# EAGLE design HAB_APRS_V1.0 (EAGLE 9.5.1)
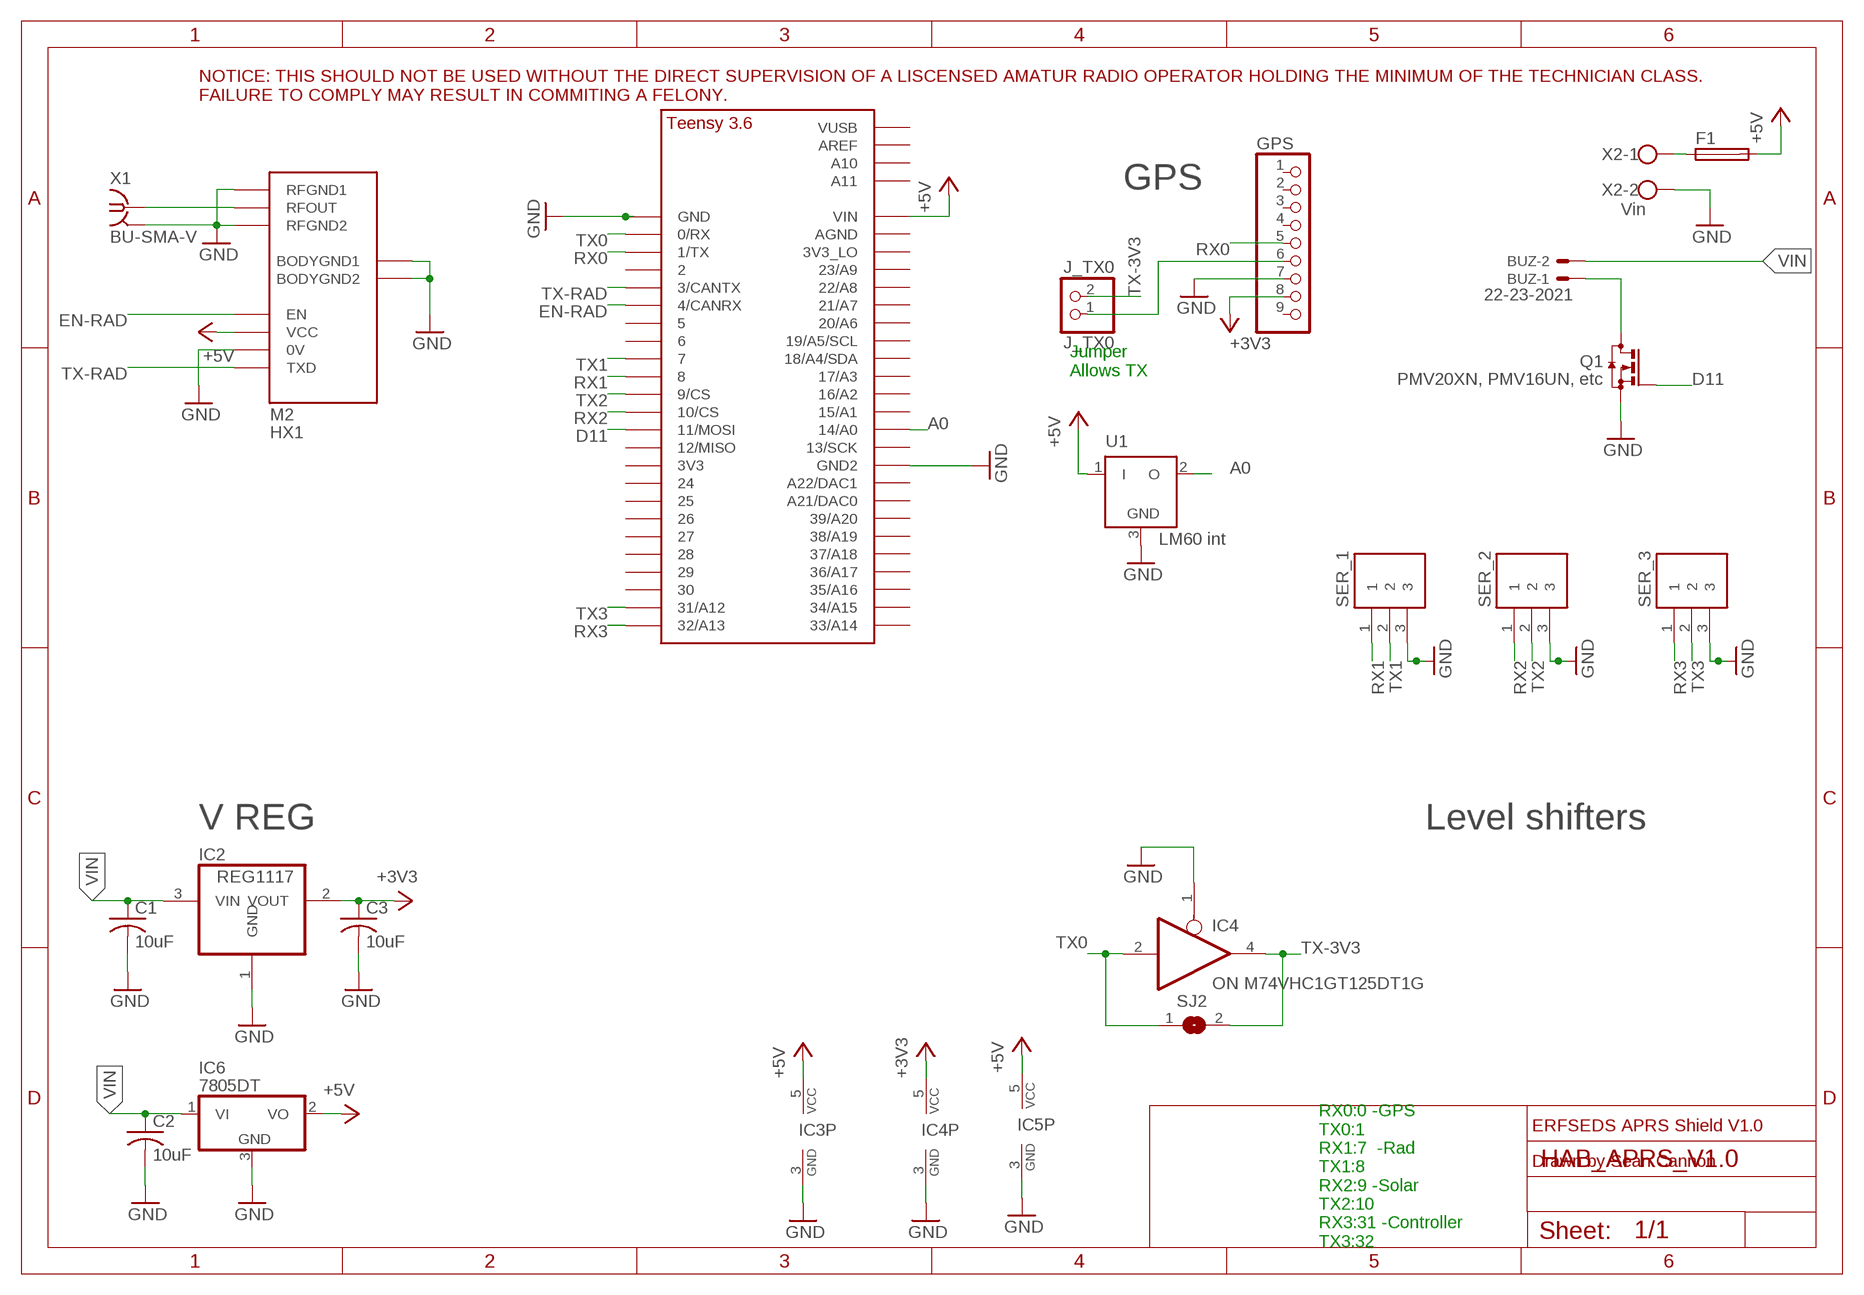
[diagram p0: schematic, sheet 1]

## Parts
BUZ  22-23-2021  [22-23-2021]
C1  10uF  C-USC0805  [C0805]
C2  10uF  C-USC0805  [C0805]
C3  10uF  C-USC0805  [C0805]
F1  FUSE_CHIP(6126-METRIC)  [FUSC6126X294N]
GPS  PINHD-1X9  [1X09-BIG]
IC2  REG1117  [SOT223]
IC3  ON M74VHC1GT125DT1G  74AHC1G125DBV  [SOT23-5]
IC4  ON M74VHC1GT125DT1G  74AHC1G125DBV  [SOT23-5]
IC5  ON M74VHC1GT125DT1G  74AHC1G125DBV  [SOT23-5]
IC6  7805DT  [TO252]
J_TX0  J_TX0  PINHD-1X2  [1X02]
M2  HX1  [HX1]
Q1  PMV20XN, PMV16UN, etc  BSS123  [SOT23]
SER_1  MOLEX_SL_03-70551  [SL_70551_3]
SER_2  MOLEX_SL_03-70551  [SL_70551_3]
SER_3  MOLEX_SL_03-70551  [SL_70551_3]
SJ2  SJ  [SJ]
U1  LM60 int  LM60  [TO92]
U$1  TEENSY_3.5/3.6_BASIC  [TEENSY_3.5/3.6_BASIC]
X1  BU-SMA-V  [BU-SMA-V]
X2  Vin  W237-102  [W237-102]

## Nets
+3V3 [20]: C3.1 GPS.8 IC2.2(VOUT) IC4.5(VCC)
+5V [20]: F1.2 IC3.5(VCC) IC5.5(VCC) IC6.2(VO) M2.VCC U1.1(I) U$1.VIN
A0: U1.2(O) U$1.14/A0
D11: Q1.1(G) U$1.11/MOSI
EN-RAD: M2.EN U$1.4/CANRX
GND: C1.2 C2.2 C3.2 GPS.7 IC2.1(GND) IC3.3(GND) IC4.1(OE) IC4.3(GND) IC5.3(GND) IC6.3(GND) M2.0V M2.BODYGND1 M2.BODYGND2 M2.RFGND1 M2.RFGND2 Q1.2(S) SER_1.3 SER_2.3 SER_3.3 U1.3(GND) U$1.GND U$1.GND2 X1.2(GND) X2.2
N$1: BUZ.1 Q1.3(D)
N$2: GPS.6 J_TX0.1
N$8: F1.1 X2.1
RFOUT [20]: M2.RFOUT X1.1
RX0: GPS.5 U$1.1/TX
RX1: SER_1.1 U$1.8
RX2: SER_2.1 U$1.10/CS
RX3: SER_3.1 U$1.32/A13
TX0: IC4.2(I) SJ2.1 U$1.0/RX
TX1: SER_1.2 U$1.7
TX2: SER_2.2 U$1.9/CS
TX3: SER_3.2 U$1.31/A12
TX-3V3: IC4.4(O) J_TX0.2 SJ2.2
TX-RAD: M2.TXD U$1.3/CANTX
VIN [30]: BUZ.2 C1.1 C2.1 IC2.3(VIN) IC6.1(VI)
Unconnected: GPS.1 GPS.2 GPS.3 GPS.4 GPS.9 IC3.1(OE) IC3.2(I) IC3.4(O) IC5.1(OE) IC5.2(I) IC5.4(O) U$1.2 U$1.3V3 U$1.3V3_LO U$1.5 U$1.6 U$1.12/MISO U$1.13/SCK U$1.15/A1 U$1.16/A2 U$1.17/A3 U$1.18/A4/SDA U$1.19/A5/SCL U$1.20/A6 U$1.21/A7 U$1.21/DAC0(A21/DAC0) U$1.22/A8 U$1.23/A9 U$1.24 U$1.25 U$1.26 U$1.27 U$1.28 U$1.29 U$1.30 U$1.33/A14 U$1.34/A15 U$1.35/A16 U$1.36/A17 U$1.37/A18 U$1.38/A19 U$1.39/A20 U$1.A10 U$1.A11 U$1.A22/DAC1 U$1.AGND U$1.AREF U$1.VUSB

## Notes on the sheet
- NOTICE: THIS SHOULD NOT BE USED WITHOUT THE DIRECT SUPERVISION OF A LISCENSED AMATUR RADIO OPERATOR HOLDING THE MINIMUM OF THE TECHNICIAN CLASS. 
  FAILURE TO COMPLY MAY RESULT IN COMMITING A FELONY.
- GPS
- Jumper
  Allows TX
- V REG | Level shifters
- ERFSEDS APRS Shield V1.0
- Drawn by Sean Cannon
- RX0:0 -GPS
  TX0:1
  RX1:7  -Rad
  TX1:8
  RX2:9 -Solar
  TX2:10
  RX3:31 -Controller
  TX3:32

## Power pins joined to a net without a drawn wire
GND: X1.3(GND) X1.4(GND) X1.5(GND)

## Library data of the parts
BUZ = con-molex:22-23-2021: .100" (2.54mm) Center Header - 2 Pin; MF: MOLEX; MPN: 22-23-2021; OC_FARNELL: 1462926; OC_NEWARK: 25C3832
C1-C3 = rcl:C-US: CAPACITOR, American symbol; SPICEPREFIX: C
F1 = Circuit-Protection:FUSE: Fuse - Generic; CATEGORY: Circuit-Protection; SUB-CATEGORY: Fuse
GPS = adafruit:PINHD-1X9: Pin header 1x10 0.1" spacing With round pins
IC2 = burr-brown:REG1117: 800mA and 1A Low Dropout (LDO) Positive Regulator 1.8V, 2.5V, 2.85V, 3.3V, 5V, and Adj; MPN: REG1117; OC_FARNELL: 1097566; OC_NEWARK: 14P6981
IC3-IC5 = 74xx-little-us:74*1G125: Single Bus Buffer Gate with 3-State Output
IC6 = adafruit:78*: Positive VOLTAGE REGULATOR Added bigger pads to the TO-92 package
J_TX0 = pinhead:PINHD-1X2: PIN HEADER
M2 = trackuino:HX1
Q1 = transistor-small-signal:BSS123: N-CHANNEL MOS FET
SER_1-SER_3 = molex-sl-connectors_jw:MOLEX_SL_03: Molex SL-Series PCB Header, 3-Pos, 0.1" (2.54mm) Centers
SJ2 = jumper:SJ: SMD solder JUMPER
U1 = trackuino:LM60
U$1 = Teensy356:TEENSY_3.5/3.6_BASIC
X1 = con-coax:BU-SMA-V: FEMALE SMA CONNECTOR Radiall distributor RS 112-3794; OC_FARNELL: unknown; OC_NEWARK: unknown
X2 = con-wago-500:W237-102: WAGO SCREW CLAMP; MPN: 237-102; OC_FARNELL: unknown; OC_NEWARK: 70K9898

## Net classes
2 20: width 0.508 mm
3 30: width 0.762 mm

## Board
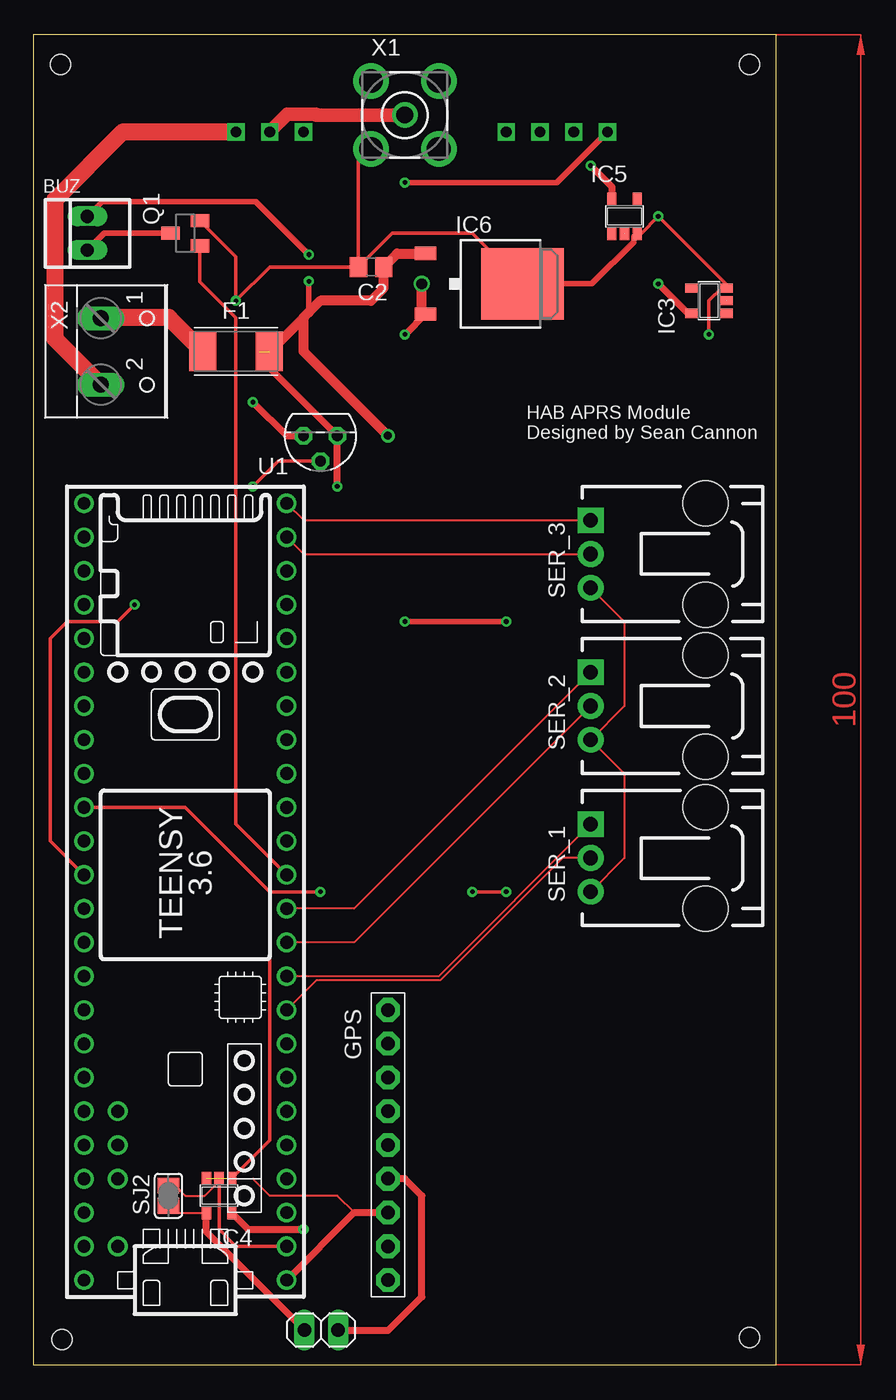
[diagram p1: board, top side]
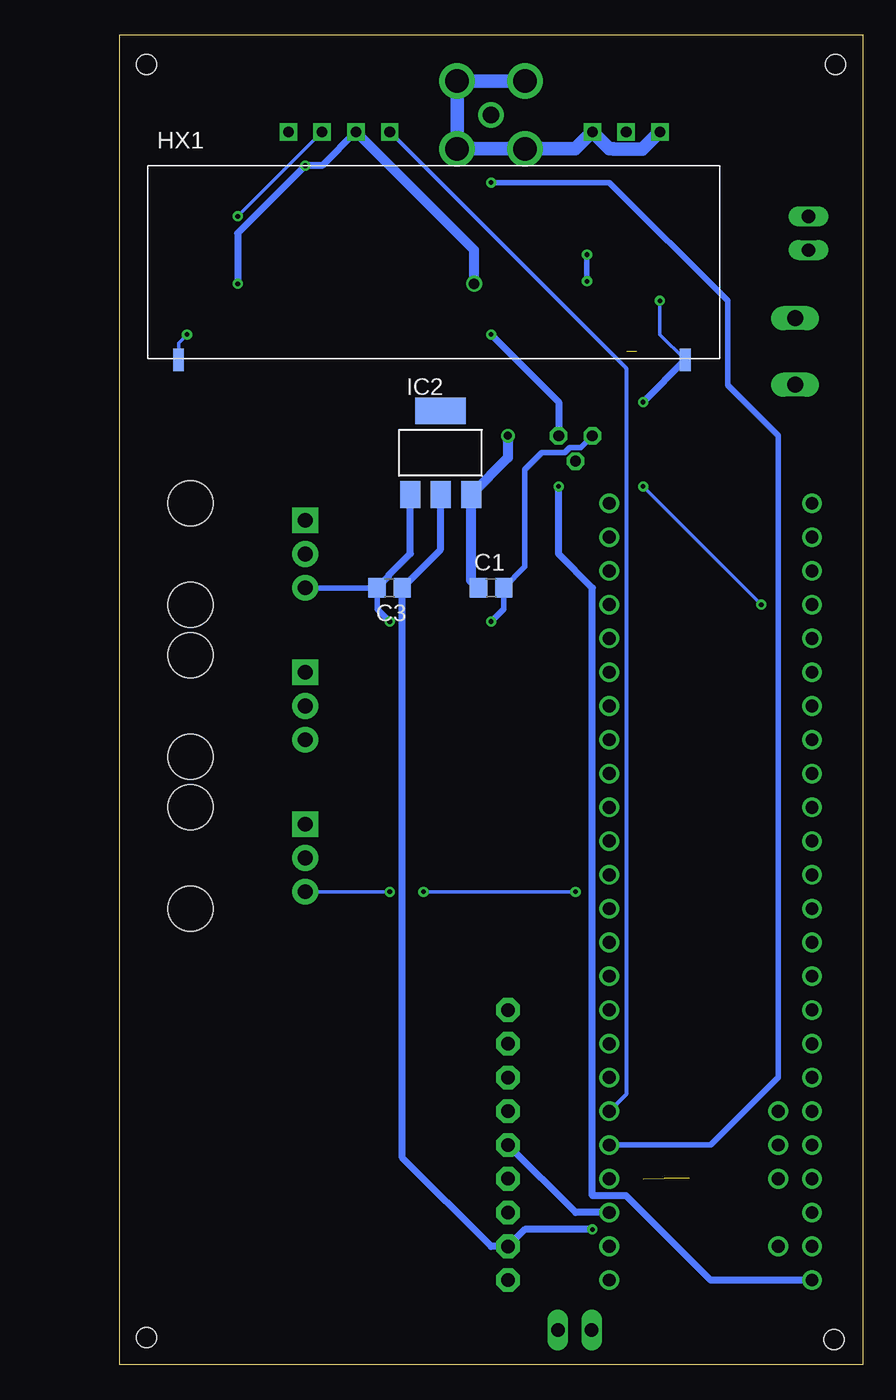
[diagram p2: board, bottom side, seen from below]

Size 55.86 x 100 mm. Coordinates in mm from the lower left corner, seen from the top.
Outline: 0,0 55.86,0 55.86,100 0,100 0,0
Copper layers (1*16): Top 0.035mm / dielectric 1.5mm / Bottom 0.035mm
Design rules "default": minimum track width 6mil, minimum drill 0.35mm, track to track 6mil, track to pad 6mil, pad to pad 6mil, via to via 6mil, smd to smd 6mil, copper to edge 40mil, drill to drill 6mil, minimum pad ring 10mil, minimum via ring 8mil, stop-mask expansion 4mil, vias tented up to drill 0mil, thermal gap 10mil
Holes 1.52 mm at 2.04,97.79 53.84,97.79 53.84,2.04 2.16,1.89

### Footprints (pad centres in the part's own frame; a part is rotated, then mirrored left to right if it is on the bottom)
22-23-2021 = drill 1 long: 1 -1.27,0; 2 1.27,0
C0805 = smd 1.3 x 1.5: 1 -0.95,0; 2 0.95,0
FUSC6126X294N = smd 2.015 x 2.952: 1 -2.5,0; 2 2.5,0
1X09-BIG = drill 1.016 pad 1.778 octagon: 1 -10.16,0; 2 -7.62,0; 3 -5.08,0; 4 -2.54,0; 5 0,0; 6 2.54,0; 7 5.08,0; 8 7.62,0; 9 10.16,0
SOT223 = smd 1.499 x 2.007: 1 -2.261,-3.15; 2 0.025,-3.15; 3 2.311,-3.15 | smd 3.81 x 2.007: 4 0,3.15
SOT23-5 = smd 0.69 x 0.99: 1 -0.95,-1.29; 2 0,-1.29; 3 0.95,-1.29; 4 0.95,1.3; 5 -0.95,1.3
TO252 = smd 1 x 1.6: 1 -2.28,-4.8; 2 2.28,-4.8 | smd 5.4 x 6.2: 3 0,2.5
1X02 = drill 1.016 long: 1 -1.27,0; 2 1.27,0
HX1 = drill 0.8 square: 0V 25.4,-8.89; EN 20.32,-8.89; RFGND1 0,-8.89; RFGND2 5.08,-8.89; RFOUT 2.54,-8.89; TXD 27.94,-8.89; VCC 22.86,-8.89 | smd 0.813 x 1.676: BODYGND1 -1.905,8.255; BODYGND2 36.195,8.255
SOT23 = smd 1 x 1.4: 1 -0.95,-1.1; 2 0.95,-1.1; 3 0,1.1
SL_70551_3 = drill 1.1 pad 1.93 square: 1 -2.54,-5.08 | drill 1.1 pad 1.93: 2 0,-5.08; 3 2.54,-5.08 | hole 3.404: -3.81,3.556; 3.81,3.556
SJ = smd 1.168 x 1.6: 1 -0.762,0; 2 0.762,0
TO92 = drill 0.813 octagon: 1 -1.27,0; 2 0,1.905; 3 1.27,0
TEENSY_3.5/3.6_BASIC = drill 0.965: 0/RX -25.4,-7.62; 1/TX -22.86,-7.62; 2 -20.32,-7.62; 3/CANTX -17.78,-7.62; 3V3 7.62,-7.62; 3V3_LO -22.86,7.62; 4/CANRX -15.24,-7.62; 5 -12.7,-7.62; 6 -10.16,-7.62; 7 -7.62,-7.62; 8 -5.08,-7.62; 9/CS -2.54,-7.62; 10/CS 0,-7.62; 11/MOSI 2.54,-7.62; 12/MISO 5.08,-7.62; 13/SCK 5.08,7.62; 14/A0 2.54,7.62; 15/A1 0,7.62; 16/A2 -2.54,7.62; 17/A3 -5.08,7.62; 18/A4/SDA -7.62,7.62; 19/A5/SCL -10.16,7.62; 20/A6 -12.7,7.62; 21/A7 -15.24,7.62; 21/DAC0 12.7,7.62; 22/A8 -17.78,7.62; 23/A9 -20.32,7.62; 24 10.16,-7.62; 25 12.7,-7.62; 26 15.24,-7.62; 27 17.78,-7.62; 28 20.32,-7.62; 29 22.86,-7.62; 30 25.4,-7.62; 31/A12 27.94,-7.62; 32/A13 30.48,-7.62; 33/A14 30.48,7.62; 34/A15 27.94,7.62; 35/A16 25.4,7.62; 36/A17 22.86,7.62; 37/A18 20.32,7.62; 38/A19 17.78,7.62; 39/A20 15.24,7.62; A10 -17.78,5.08; A11 -15.24,5.08; A22/DAC1 10.16,7.62; AGND -25.4,7.62; AREF -20.32,5.08; GND -27.94,-7.62; GND2 7.62,7.62; VIN -27.94,7.62; VUSB -25.4,5.08
BU-SMA-V = drill 1.27: 1 0,0 | drill 1.778: 2 -2.55,2.55; 3 2.55,2.55; 4 2.55,-2.55; 5 -2.55,-2.55
W237-102 = drill 1.194 long: 1 -2.5,-1.27; 2 2.5,-1.27

### Placement (x,y rotation side)
BUZ  4.06,85.09 90 top
C1  27.94,58.42 0 bottom
C2  25.4,82.55 180 top
C3  35.56,58.42 180 bottom
F1  15.24,76.2 0 top
GPS  26.67,16.51 270 top
IC2  31.75,68.58 0 bottom
IC3  50.8,80.01 90 top
IC4  13.97,12.7 180 top
IC5  44.45,86.36 0 top
IC6  34.29,81.28 270 top
J_TX0  21.65,2.6 180 top
M2  15.24,83.82 180 bottom
Q1  11.43,85.09 90 top
SER_1  46.99,38.1 270 top
SER_2  46.99,49.53 270 top
SER_3  46.99,60.96 270 top
SJ2  10.16,12.7 270 top
U1  21.59,69.85 180 top
U$1  11.43,34.29 90 top
X1  27.94,93.98 0 top
X2  6.35,76.2 270 top

### Tracks (layer width: path | path; a pad name or v marks a point on that pad's centre or on a via)
+3V3  (via drill 0.35)
  Top 0.508: IC4.5 16.16,10.16 v20.32,10.16
  Bottom 0.508: v20.32,10.16 25.4,10.16 GPS.8 27.94,8.89 34.61,15.56 C3.1 31.72,61.31 IC2.2
+5V  (via drill 0.35, 0.8)  (1 unrouted)
  Top 0.508: v41.91,90.17 43.5,88.58 IC5.5 | v46.99,81.28 49.21,79.06 IC3.5 | IC6.2 27.96,77.47 v27.94,77.47 | v22.86,66.04 U1.1 16.99,75.72 16.99,76.2
  Top 0.762: IC6.2 29.21,79.28 v29.21,81.28
  Bottom 0.508: M2.VCC 40.64,90.17 v41.91,90.17 46.99,85.09 v46.99,81.28 | v27.94,77.47 22.86,72.39 U1.1 | U$1.VIN 11.43,6.35 17.78,12.7 20.32,12.7 20.32,58.42 22.86,60.96 v22.86,66.04
  Bottom 0.762: v29.21,81.28 29.21,83.82 M2.VCC
A0  (via drill 0.35)
  Top 0.254: U1.2 18.41,67.95 v16.51,66.04 | U$1.14/A0 1.27,39.37 1.27,54.61 2.54,55.88 6.35,55.88 v7.62,57.15
  Bottom 0.254: v16.51,66.04 v7.62,57.15
D11
  Top 0.254: Q1.1 12.53,81.45 15.24,78.74 15.24,40.64 U$1.11/MOSI
EN-RAD
  Bottom 0.305: M2.EN 17.78,74.93 17.78,20.32 U$1.4/CANRX
GND  (via drill 0.35)  (2 unrouted)
  Top 0.152: SER_3.3 44.45,55.88 44.45,49.53 SER_2.3 44.45,44.45 44.45,38.1 SER_1.3 | 24.13,11.43 22.86,12.7 17.78,12.7 16.51,13.97
  Top 0.254: X1.5 24.45,90.49 C2.2 | C2.2 26.99,85.09 33.02,85.09 36.79,81.32 IC6.3 | Q1.2 15.24,83.33 v15.24,80.01 17.78,82.55 C2.2 | IC5.3 45.7,85.07 v46.99,86.36 52.09,81.26 IC3.3 51.75,80.96 50.8,80.01 v50.8,77.47 | U$1.GND2 11.43,41.91 17.78,35.56 | 17.78,35.56 v21.59,35.56 | v33.02,35.56 v35.56,35.56 | IC4.1 17.78,16.85 17.78,35.56
  Top 0.406: IC5.3 45.15,84.82 45.15,84.43 42,81.28 IC6.3 | v27.94,55.88 v35.56,55.88
  Top 0.508: U$1.GND 24.13,11.43 GPS.7 | v16.51,72.39 19.05,69.85 U1.3
  Top 1.27: X2.2 1.65,77.13 1.65,87.63 6.73,92.71 M2.RFGND1
  Bottom 0.254: v15.24,80.01 15.24,77.47 M2.BODYGND1 | M2.0V v46.99,86.36 | v50.8,77.47 51.44,76.84 M2.BODYGND2 | v21.59,35.56 v33.02,35.56 | v35.56,35.56 SER_1.3
  Bottom 0.406: U1.3 21.21,68.96 22.01,68.96 22.39,68.58 24.13,68.58 25.4,67.31 25.4,60.01 C1.2 26.99,56.83 v27.94,55.88 | SER_3.3 C3.2 36.51,56.83 v35.56,55.88
  Bottom 0.508: C3.2 35.67,59.26 35.67,59.34 34.01,60.99 IC2.1 | M2.BODYGND1 v16.51,72.39
  Bottom 1.016: M2.RFGND1 16.55,91.4 18.71,91.4 18.75,91.44 19.05,91.44 M2.RFGND2 21.6,91.43 X1.5 X1.4 X1.3 X1.2
N$1
  Top 0.406: BUZ.1 5.33,85.09 Q1.3
N$2
  Top 0.508: GPS.6 27.94,13.97 29.21,12.7 29.21,5.08 26.67,2.54 22.99,2.54 J_TX0.1
N$8
  Top 1.27: X2.1 5.12,78.74 10.2,78.74 F1.1
RFOUT
  Top 1.016: X1.1 21.29,93.98 21.25,94.02 19.09,94.02 M2.RFOUT
RX0
  Bottom 0.508: U$1.1/TX 21.59,11.43 GPS.5
RX1
  Top 0.152: SER_1.1 30.48,29.21 U$1.8
RX2
  Top 0.152: SER_2.1 24.13,34.29 U$1.10/CS
RX3
  Top 0.152: 20.32,63.5 SER_3.1
  Top 0.203: U$1.32/A13 20.32,63.5
TX0
  Top 0.152: SJ2.1 10.67,13.46 11.43,12.7 12.89,12.7 13.97,13.78 IC4.2
  Top 0.254: IC4.2 13.97,10.16 15.24,8.89 U$1.0/RX
TX1
  Top 0.152: U$1.7 21.29,28.9 30.61,28.9 39.8,38.1 SER_1.2
TX2
  Top 0.152: SER_2.2 24.13,31.75 U$1.9/CS
TX3
  Top 0.152: 20.32,60.96 SER_3.2
  Top 0.203: U$1.31/A12 20.32,60.96
TX-3V3
  Top 0.152: SJ2.2 10.7,11.4 IC4.4
  Top 0.508: J_TX0.2 13.02,9.97 IC4.4
TX-RAD  (via drill 0.35)
  Top 0.406: M2.TXD 39.37,88.9 v27.94,88.9
  Bottom 0.406: U$1.3/CANTX 11.43,16.51 6.35,21.59 6.35,69.85 10.16,73.66 10.16,80.01 19.05,88.9 v27.94,88.9
VIN  (via drill 0.35, 0.6)
  Top 0.406: 20.73,79.15 v20.73,81.47 | v20.73,83.47 16.73,87.47 5.18,87.47 BUZ.2
  Top 0.762: IC6.1 27.36,83.56 C2.1 26.35,80.96 25.4,80.01 21.59,80.01 20.73,79.15 20.39,78.81 20.32,78.74 | 17.78,76.2 20.32,78.74 | v26.67,69.85 20.32,76.2 20.32,78.74
  Bottom 0.406: v20.73,81.47 v20.73,83.47
  Bottom 0.762: v26.67,69.85 26.67,68.2 IC2.3 29.44,58.97 C1.1
(copper drawn outside any net)
  shapes: Top area x1

### Text on the board
tNames: HAB APRS Module / Designed by Sean Cannon
bValues: NOTICE: THIS SHOULD NOT BE USED WITHOUT / THE DIRECT SUPERVISION OF A / LISCENSED AMATUR RADIO OPERATOR / HOLDING THE MINIMUM OF THE TECHNICIAN CLASS. / FAILURE TO COMPLY MAY RESULT IN COMMITING / A FELONY.